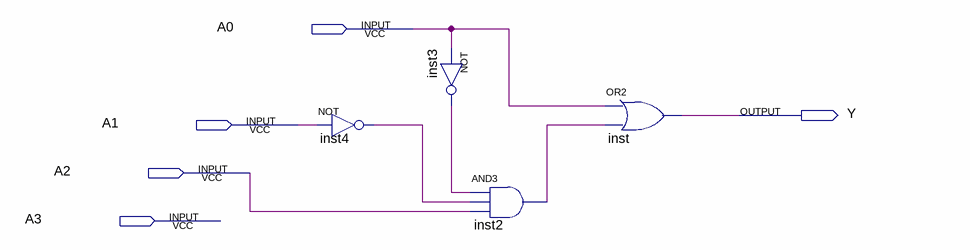
[diagram p0: schematic sheet]
// Quartus schematic Segment4.bdf as structural Verilog: 4 symbols, 5 pins
module Segment4 (
  input  A0,
  input  A1,
  input  A2,
  input  A3,
  output Y
);

  wire inst2_out, inst3_out, inst4_out;

  not inst4 (inst4_out, A1);
  not inst3 (inst3_out, A0);
  and inst2 (inst2_out, inst3_out, inst4_out, A2);
  or inst (Y, A0, inst2_out);
endmodule
